# EAGLE design rgb-led-cc-driver-mk-3.0 (EAGLE 6.5.0)
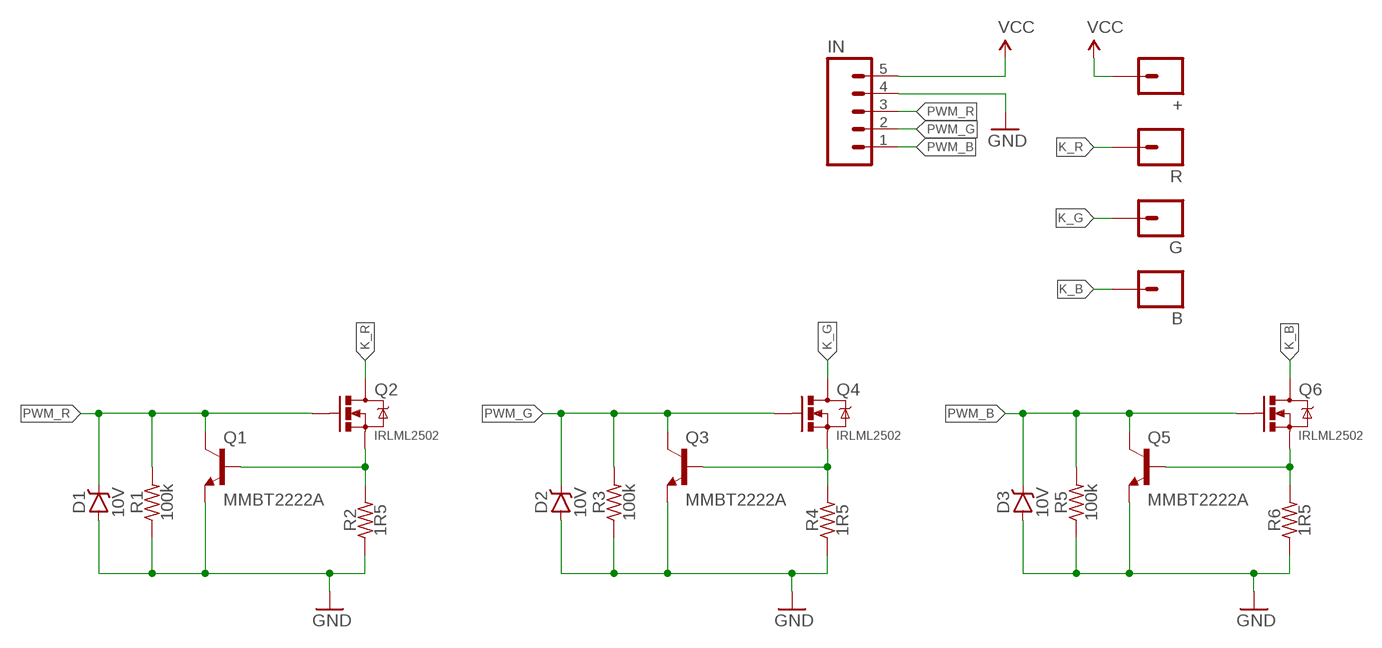
[diagram p0: schematic, sheet 1]

## Parts
+  M01PTH_2MM  [1X01_2MM]
B  M01PTH_2MM  [1X01_2MM]
D1  10V  DIODE-ZENERSOD123  [SOD123-ZENER]
D2  10V  DIODE-ZENERSOD123  [SOD123-ZENER]
D3  10V  DIODE-ZENERSOD123  [SOD123-ZENER]
G  M01PTH_2MM  [1X01_2MM]
IN  M05PTH  [1X05]
Q1  MMBT2222A  TRANSISTOR_NPNMMBT2222A  [SOT23]
Q2  IRLML2502  MOSFET-NCHANNELIRLML2502  [SOT23]
Q3  MMBT2222A  TRANSISTOR_NPNMMBT2222A  [SOT23]
Q4  IRLML2502  MOSFET-NCHANNELIRLML2502  [SOT23]
Q5  MMBT2222A  TRANSISTOR_NPNMMBT2222A  [SOT23]
Q6  IRLML2502  MOSFET-NCHANNELIRLML2502  [SOT23]
R  M01PTH_2MM  [1X01_2MM]
R1  100k  RESISTORR0805  [R0805]
R2  1R5  RESISTORR1206  [R1206]
R3  100k  RESISTORR0805  [R0805]
R4  1R5  RESISTORR1206  [R1206]
R5  100k  RESISTORR0805  [R0805]
R6  1R5  RESISTORR1206  [R1206]

## Nets
GND: D1.A D2.A D3.A IN.4 Q1.2(E) Q3.2(E) Q5.2(E) R1.1 R2.1 R3.1 R4.1 R5.1 R6.1
K_B: B.1 Q6.3(D)
K_G: G.1 Q4.3(D)
K_R: Q2.3(D) R.1
N$1: Q1.1(B) Q2.2(S) R2.2
N$2: Q3.1(B) Q4.2(S) R4.2
N$3: Q5.1(B) Q6.2(S) R6.2
PWM_B: D3.C IN.1 Q5.3(C) Q6.1(G) R5.2
PWM_G: D2.C IN.2 Q3.3(C) Q4.1(G) R3.2
PWM_R: D1.C IN.3 Q1.3(C) Q2.1(G) R1.2
VCC: +.1 IN.5

## Library data of the parts
+ B G R = A_butts:M01: Header 1 Standard 1-pin 0.1" header. Use with straight break away headers (SKU : PRT-00116), right angle break away headers (PRT-00553), swiss pins (PRT-00743), machine pins (PRT-00117), and female headers (PRT-00115).
D1-D3 = A_butts:DIODE-ZENER: Zener Diode Production Part - 8199 3.4V Zener Voltage
IN = A_butts:M05: Header 5 Standard 5-pin 0.1" header. Use with straight break away headers (SKU : PRT-00116), right angle break away headers (PRT-00553), swiss pins (PRT-00743), machine pins (PRT-00117), and female headers (PRT-00115). Molex polarized connector foot print use with SKU : PRT-08230 with associated crimp pins and housings.
Q1 Q3 Q5 = A_butts:TRANSISTOR_NPN: Generic NPN BJT MMBT2222A - TRANS-08049 (SOT-23, 1A 40V) MPSA42 - TRANS-09116 (SOT-23, 500mA 300V) MMBT5088LT1G - TRANS-11160 (SOT-23, 50 mA 30V) BC547 - COM-08928 <http://www.sparkfun.com/products/8928> (TO-92 45V 100mA) (1.Collector 2.Base 3.Emitter) 2N3904 - COM-00521 <http://www.sparkfun.com/products/521> (TO-92 40V 200mA) (1.Emitter 2.Base 3.Collector) P2N2222A - COM-12852 <http://www.sparkfun.com/products/12852> (TO-92 40V 600mA) (1.Collector 2.Base 3.Emitter)
Q2 Q4 Q6 = A_butts:MOSFET-NCHANNEL: Common NMOSFET Parts MFG P/N Store ID Prod ID FDD8780 TRANS-09984 SI7820DN TRANS-11055 FDS6630A IC-08089 2N7002PW TRANS-11151 FQP30N06L COM-10213 TRANS-10060 BSS123LT1G TRANS-08345 BSS138 TRANS-00830 BS170 2N7000
R1-R6 = A_butts:RESISTOR: RESISTOR, American symbol

## Board
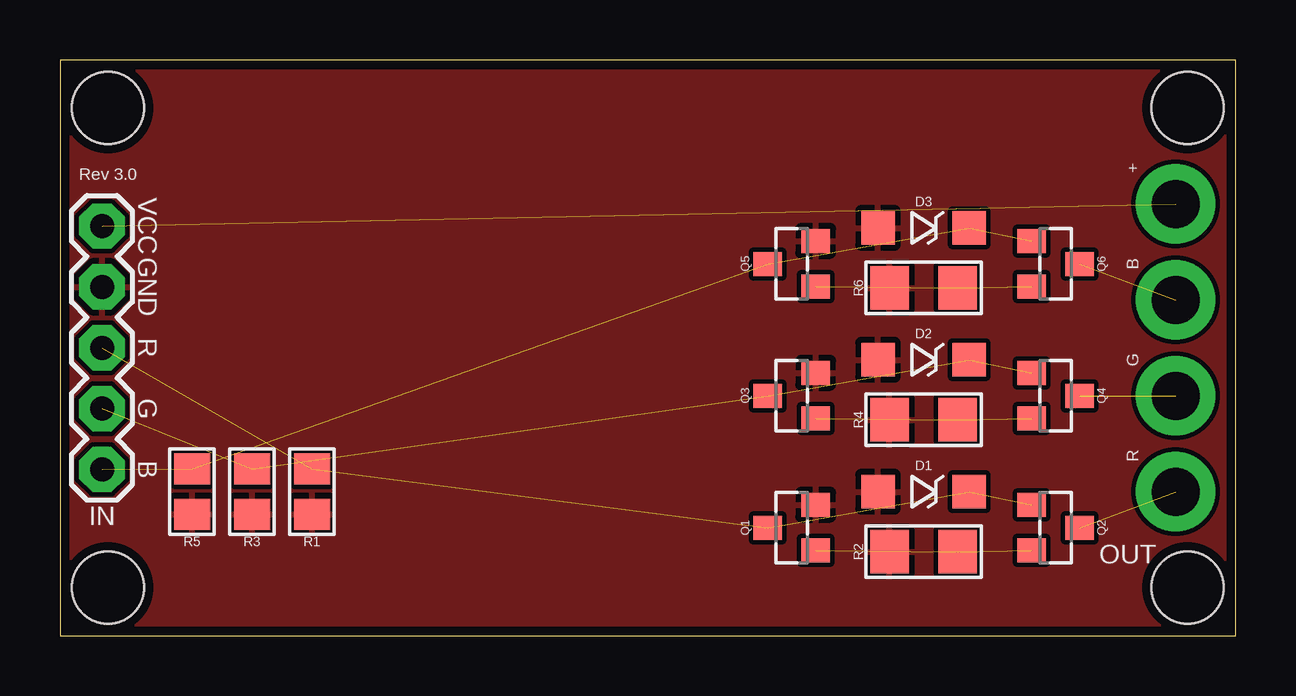
[diagram p1: board, top side]
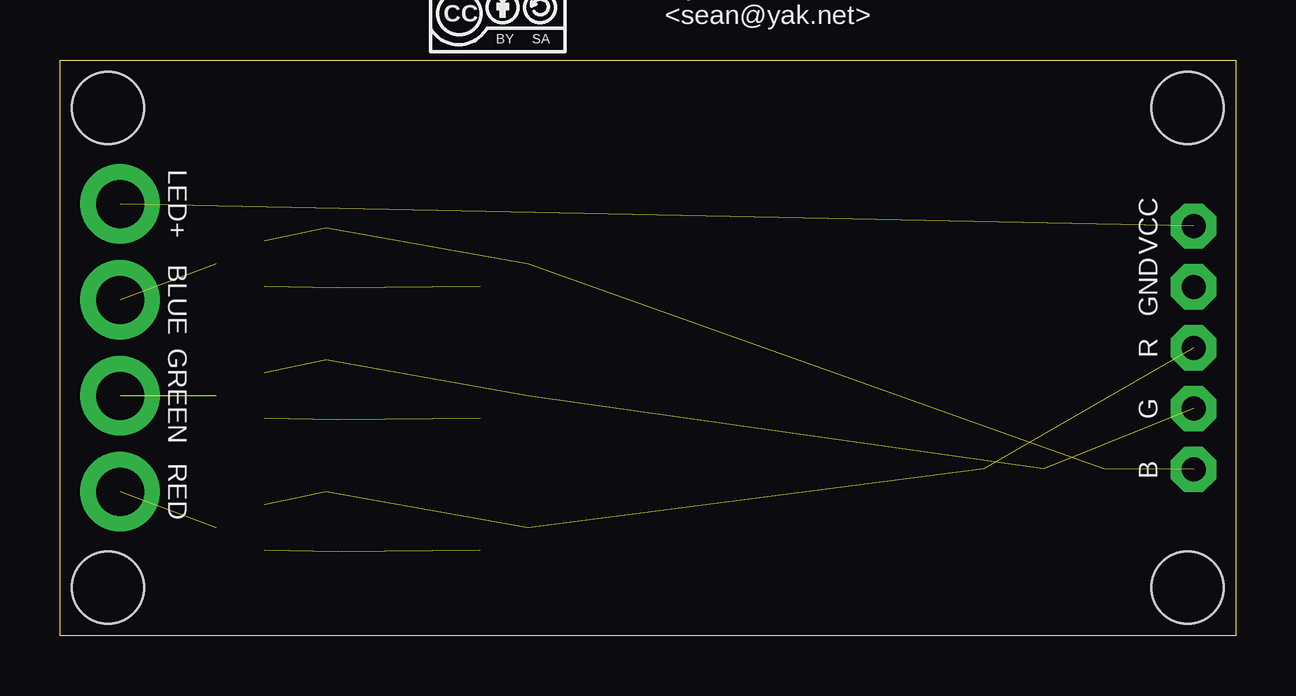
[diagram p2: board, bottom side, seen from below]

Size 49 x 24 mm. Coordinates in mm from the lower left corner, seen from the top.
Outline: 0,24 0,0 49,0 49,24 0,24
Copper layers (1*16): Top 0.0356mm / dielectric 1.5011mm / Bottom 0.0356mm
Design rules "LaenPCBOrder2": minimum track width 6mil, minimum drill 13mil, track to track 6mil, track to pad 6mil, pad to pad 6mil, via to via 6mil, smd to smd 6mil, copper to edge 15mil, drill to drill 6mil, minimum pad ring 7mil, minimum via ring 7mil, stop-mask expansion 3mil, vias tented up to drill 20mil, thermal gap 10mil
Holes 3 mm at 2,2 47,2 2,22 47,22

### Footprints (pad centres in the part's own frame; a part is rotated, then mirrored left to right if it is on the bottom)
1X01_2MM = drill 2 pad 3.302: 1 0,0
SOD123-ZENER = smd 1.4 x 1.4: A -1.9,0; C 1.9,0
1X05 = drill 1 pad 1.88 octagon: 1 0,0; 2 2.54,0; 3 5.08,0; 4 7.62,0; 5 10.16,0
SOT23 = smd 1 x 1.2: 1 -0.95,-1; 2 0.95,-1; 3 0,1
R0805 = smd 1.3 x 1.5: 1 -0.95,0; 2 0.95,0
R1206 = smd 1.6 x 1.8: 1 -1.42,0; 2 1.42,0

### Placement (x,y rotation side)
+  46.5,18 180 top
B  46.5,14 180 top
D1  36,6 0 top
D2  36,11.5 0 top
D3  36,17 0 top
G  46.5,10 180 top
IN  1.75,6.92 90 top
Q1  30.5,4.5 90 top
Q2  41.5,4.5 270 top
Q3  30.5,10 90 top
Q4  41.5,10 270 top
Q5  30.5,15.5 90 top
Q6  41.5,15.5 270 top
R  46.5,6 180 top
R1  10.5,6 90 top
R2  36,3.5 0 top
R3  8,6 90 top
R4  36,9 0 top
R5  5.5,6 90 top
R6  36,14.5 0 top
U$1  [CC-BY-SA-4.0-NO-URL]  30.75,25.75 0 bottom
U$2  [COW_SMALL]  19,37 0 bottom  (outside the outline)
U$3  [OSHWLOGO_BOT_0.2_A]  6.5,34.25 0 top  (outside the outline)

### Tracks (layer width: path | path; a pad name or v marks a point on that pad's centre or on a via)
GND
  pour Top (isolate 0.2): 49,0 0,0 0,24 49,24
K_B  (1 unrouted)
K_G  (1 unrouted)
K_R  (1 unrouted)
N$1  (2 unrouted)
N$2  (2 unrouted)
N$3  (2 unrouted)
PWM_B  (4 unrouted)
PWM_G  (4 unrouted)
PWM_R  (4 unrouted)
VCC  (1 unrouted)

### Text on the board
tPlace: VCC | GND | R | G | B | OUT
bPlace: R2-4 = Vcb/Iset / = 0.5/Iset / / 333mA => 1R5 / 100mA => 5R0 / 20mA => 25R | RGB LED / Constant Current / Driver | by schizobovine / <sean@yak.net> | LED+ | VCC | GND | BLUE | R | GREEN | G | B | RED